# Altium schematic sheet InterfacesA_TRANSCEIVER.SchDoc
size A
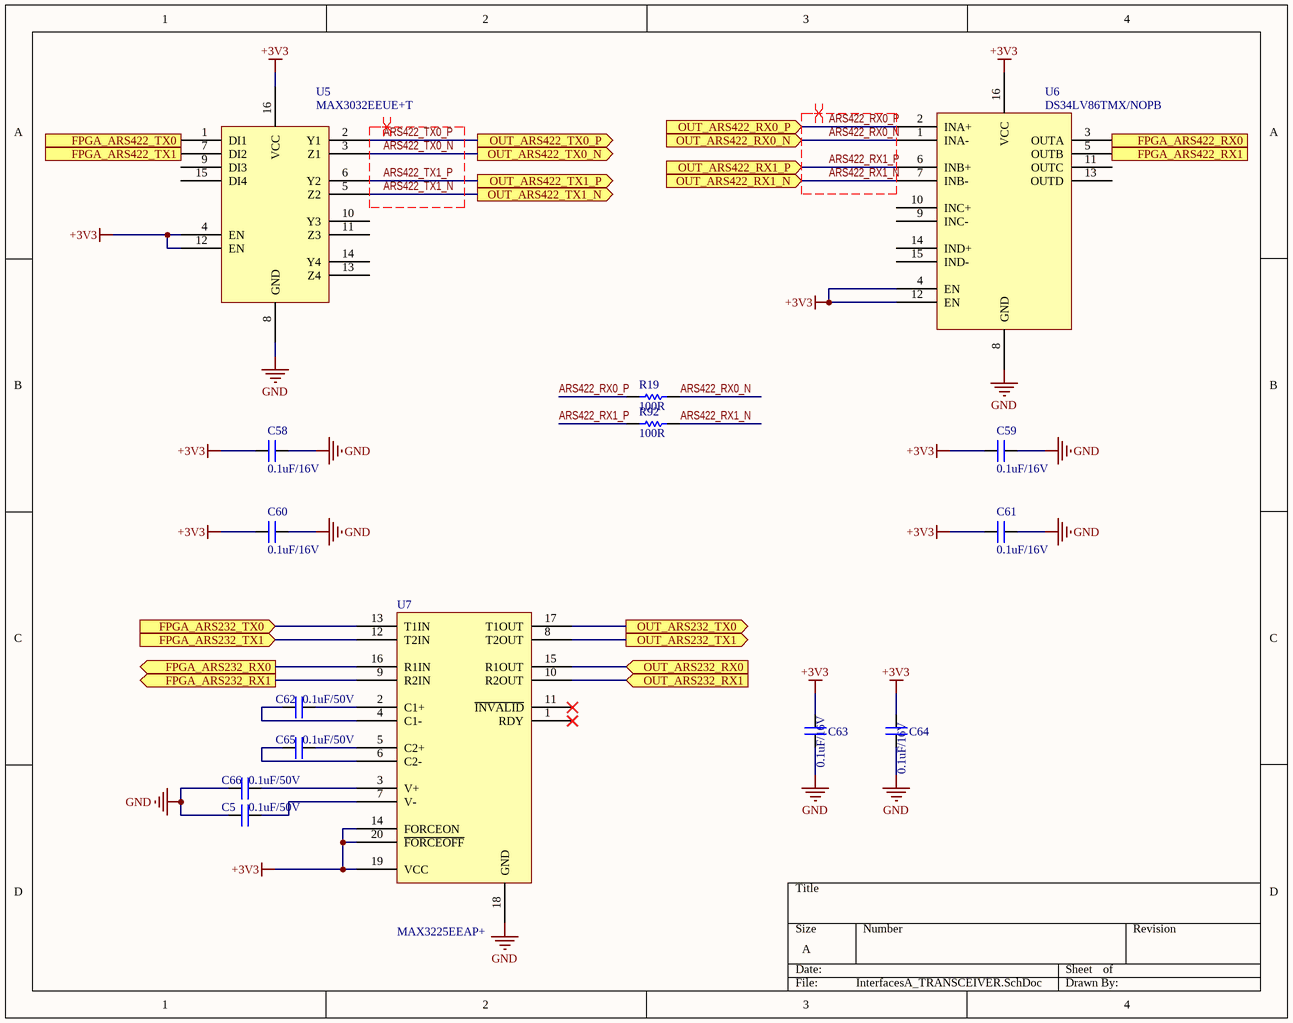
[diagram p0: InterfacesA_TRANSCEIVER.SchDoc]

## Parts
C5  value 0.1uF/50V  [CAP_0805]  (hidden comment: CAP_0805)
C58  value 0.1uF/16V  [CAP_0805]  (hidden comment: CAP_0805)
C59  value 0.1uF/16V  [CAP_0805]  (hidden comment: CAP_0805)
C60  value 0.1uF/16V  [CAP_0805]  (hidden comment: CAP_0805)
C61  value 0.1uF/16V  [CAP_0805]  (hidden comment: CAP_0805)
C62  value 0.1uF/50V  [CAP_0805]  (hidden comment: CAP_0805)
C63  value 0.1uF/16V  [CAP_0805]  (hidden comment: CAP_0805)
C64  value 0.1uF/16V  [CAP_0805]  (hidden comment: CAP_0805)
C65  value 0.1uF/50V  [CAP_0805]  (hidden comment: CAP_0805)
C66  value 0.1uF/50V  [CAP_0805]  (hidden comment: CAP_0805)
R19  value 100R  [RES_0805]  (hidden comment: RES_0805)
R92  value 100R  [RES_0805]  (hidden comment: RES_0805)
U5  MAX3032EEUE+T  [MAX3032EEUE+T]
U6  DS34LV86TMX/NOPB  [DS34LV86TMX/NOPB]
U7  MAX3225EEAP+  [MAX3225EEAP+]

## Ports
FPGA_ARS232_RX0 (out), FPGA_ARS232_RX1 (out), FPGA_ARS232_TX0 (in), FPGA_ARS232_TX1 (in), FPGA_ARS422_RX0 (out), FPGA_ARS422_RX1 (out), FPGA_ARS422_TX0 (in), FPGA_ARS422_TX1 (in), OUT_ARS232_RX0 (in), OUT_ARS232_RX1 (in), OUT_ARS232_TX0 (out), OUT_ARS232_TX1 (out), OUT_ARS422_RX0_N (in), OUT_ARS422_RX0_P (in), OUT_ARS422_RX1_N (in), OUT_ARS422_RX1_P (in), OUT_ARS422_TX0_N (out), OUT_ARS422_TX0_P (out), OUT_ARS422_TX1_N (out), OUT_ARS422_TX1_P (out)

## Nets
+3V3: C58.2 C59.2 C60.2 C61.2 C63.2 C64.2 U5.4(EN) U5.12(EN) U5.16(VCC) U6.4(EN) U6.12(EN) U6.16(VCC) U7.14(FORCEON) U7.19(VCC) U7.20(~{FORCEOFF})
GND: C5.2 C58.1 C59.1 C60.1 C61.1 C63.1 C64.1 C66.2 U5.8(GND) U6.8(GND) U7.18(GND)
ARS422_RX0_N: R19.1 U6.1(INA-) ; port OUT_ARS422_RX0_N
ARS422_RX0_P: R19.2 U6.2(INA+) ; port OUT_ARS422_RX0_P
ARS422_RX1_N: R92.1 U6.7(INB-) ; port OUT_ARS422_RX1_N
ARS422_RX1_P: R92.2 U6.6(INB+) ; port OUT_ARS422_RX1_P
ARS422_TX0_N: U5.3(Z1) ; port OUT_ARS422_TX0_N
ARS422_TX0_P: U5.2(Y1) ; port OUT_ARS422_TX0_P
ARS422_TX1_N: U5.5(Z2) ; port OUT_ARS422_TX1_N
ARS422_TX1_P: U5.6(Y2) ; port OUT_ARS422_TX1_P
FPGA_ARS232_RX0: U7.16(R1IN) ; port FPGA_ARS232_RX0
FPGA_ARS232_RX1: U7.9(R2IN) ; port FPGA_ARS232_RX1
FPGA_ARS232_TX0: U7.13(T1IN) ; port FPGA_ARS232_TX0
FPGA_ARS232_TX1: U7.12(T2IN) ; port FPGA_ARS232_TX1
FPGA_ARS422_RX0: U6.3(OUTA) ; port FPGA_ARS422_RX0
FPGA_ARS422_RX1: U6.5(OUTB) ; port FPGA_ARS422_RX1
FPGA_ARS422_TX0: U5.1(DI1) ; port FPGA_ARS422_TX0
FPGA_ARS422_TX1: U5.7(DI2) ; port FPGA_ARS422_TX1
OUT_ARS232_RX0: U7.15(R1OUT) ; port OUT_ARS232_RX0
OUT_ARS232_RX1: U7.10(R2OUT) ; port OUT_ARS232_RX1
OUT_ARS232_TX0: U7.17(T1OUT) ; port OUT_ARS232_TX0
OUT_ARS232_TX1: U7.8(T2OUT) ; port OUT_ARS232_TX1
NetC5_1: C5.1 U7.7(V-)
NetC62_1: C62.1 U7.2(C1+)
NetC62_2: C62.2 U7.4(C1-)
NetC65_1: C65.1 U7.5(C2+)
NetC65_2: C65.2 U7.6(C2-)
NetC66_1: C66.1 U7.3(V+)

Not connected (* = marked no-connect by the designer): U5 9(DI3) 10(Y3) 11(Z3) 13(Z4) 14(Y4) 15(DI4); U6 9(INC-) 10(INC+) 11(OUTC) 13(OUTD) 14(IND+) 15(IND-); U7 1(RDY)* 11(~{INVALID})*

## Layout directives
differential pair: ARS422_RX0_N, ARS422_RX0_P, ARS422_RX1_N, ARS422_RX1_P, ARS422_TX0_N, ARS422_TX0_P, ARS422_TX1_N, ARS422_TX1_P

## Library data of the parts
C5 C58-C66 = CAP_0603
U5 = MAX3032EEUE+T: Supplier 1: Digi-Key; Supplier Part Number 1: 1016-1522-5-ND
U6 = DS34LV86TMX/NOPB: Supplier 1: Digi-Key; Supplier Part Number 1: 296-13065-1-ND
U7 = MAX3225EEAP+: Supplier 1: Digi-Key; Supplier Part Number 1: MAX3225EEAP+-ND